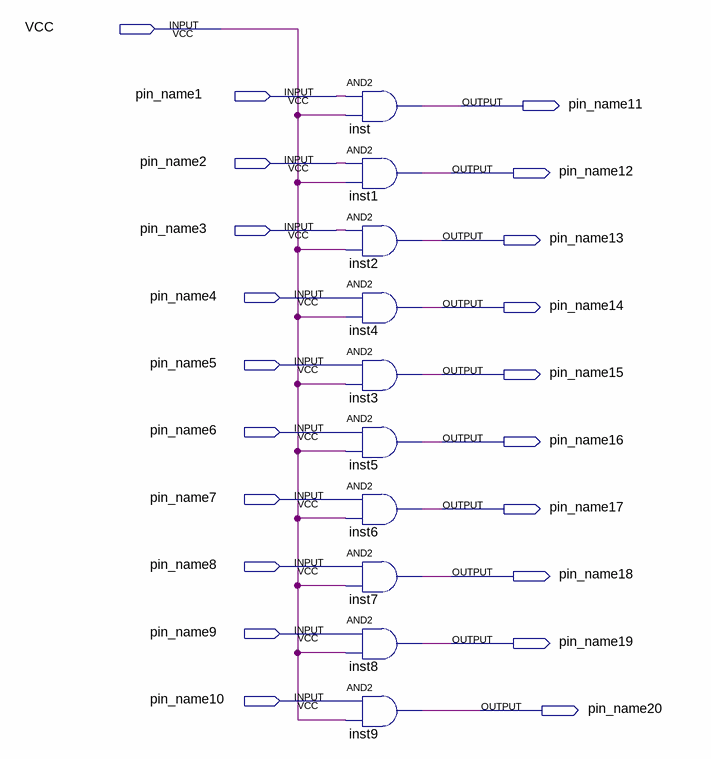
[diagram p0: schematic sheet]
// Quartus schematic Glue_Logic.bdf as structural Verilog: 10 symbols, 21 pins
module Glue_Logic (
  input  VCC,
  input  pin_name1,
  input  pin_name2,
  input  pin_name3,
  input  pin_name4,
  input  pin_name5,
  input  pin_name6,
  input  pin_name7,
  input  pin_name8,
  input  pin_name9,
  input  pin_name10,
  output pin_name11,
  output pin_name12,
  output pin_name13,
  output pin_name14,
  output pin_name15,
  output pin_name16,
  output pin_name17,
  output pin_name18,
  output pin_name19,
  output pin_name20
);

  and inst (pin_name11, pin_name1, VCC);
  and inst1 (pin_name12, pin_name2, VCC);
  and inst2 (pin_name13, pin_name3, VCC);
  and inst4 (pin_name14, pin_name4, VCC);
  and inst3 (pin_name15, pin_name5, VCC);
  and inst5 (pin_name16, pin_name6, VCC);
  and inst6 (pin_name17, pin_name7, VCC);
  and inst7 (pin_name18, pin_name8, VCC);
  and inst8 (pin_name19, pin_name9, VCC);
  and inst9 (pin_name20, pin_name10, VCC);
endmodule
